# Altium schematic sheet A3_DSTU.SchDoc: Title 0
size 420 x 297 mm; ApprovedBy: Approved by; CheckedBy: Checked by; DrawnBy: Designed by; DocumentNumber: Document Number; SheetNumber: 1; SheetTotal: 1; Title1str: Title 1; DocumentType: Document Type; Format: A3
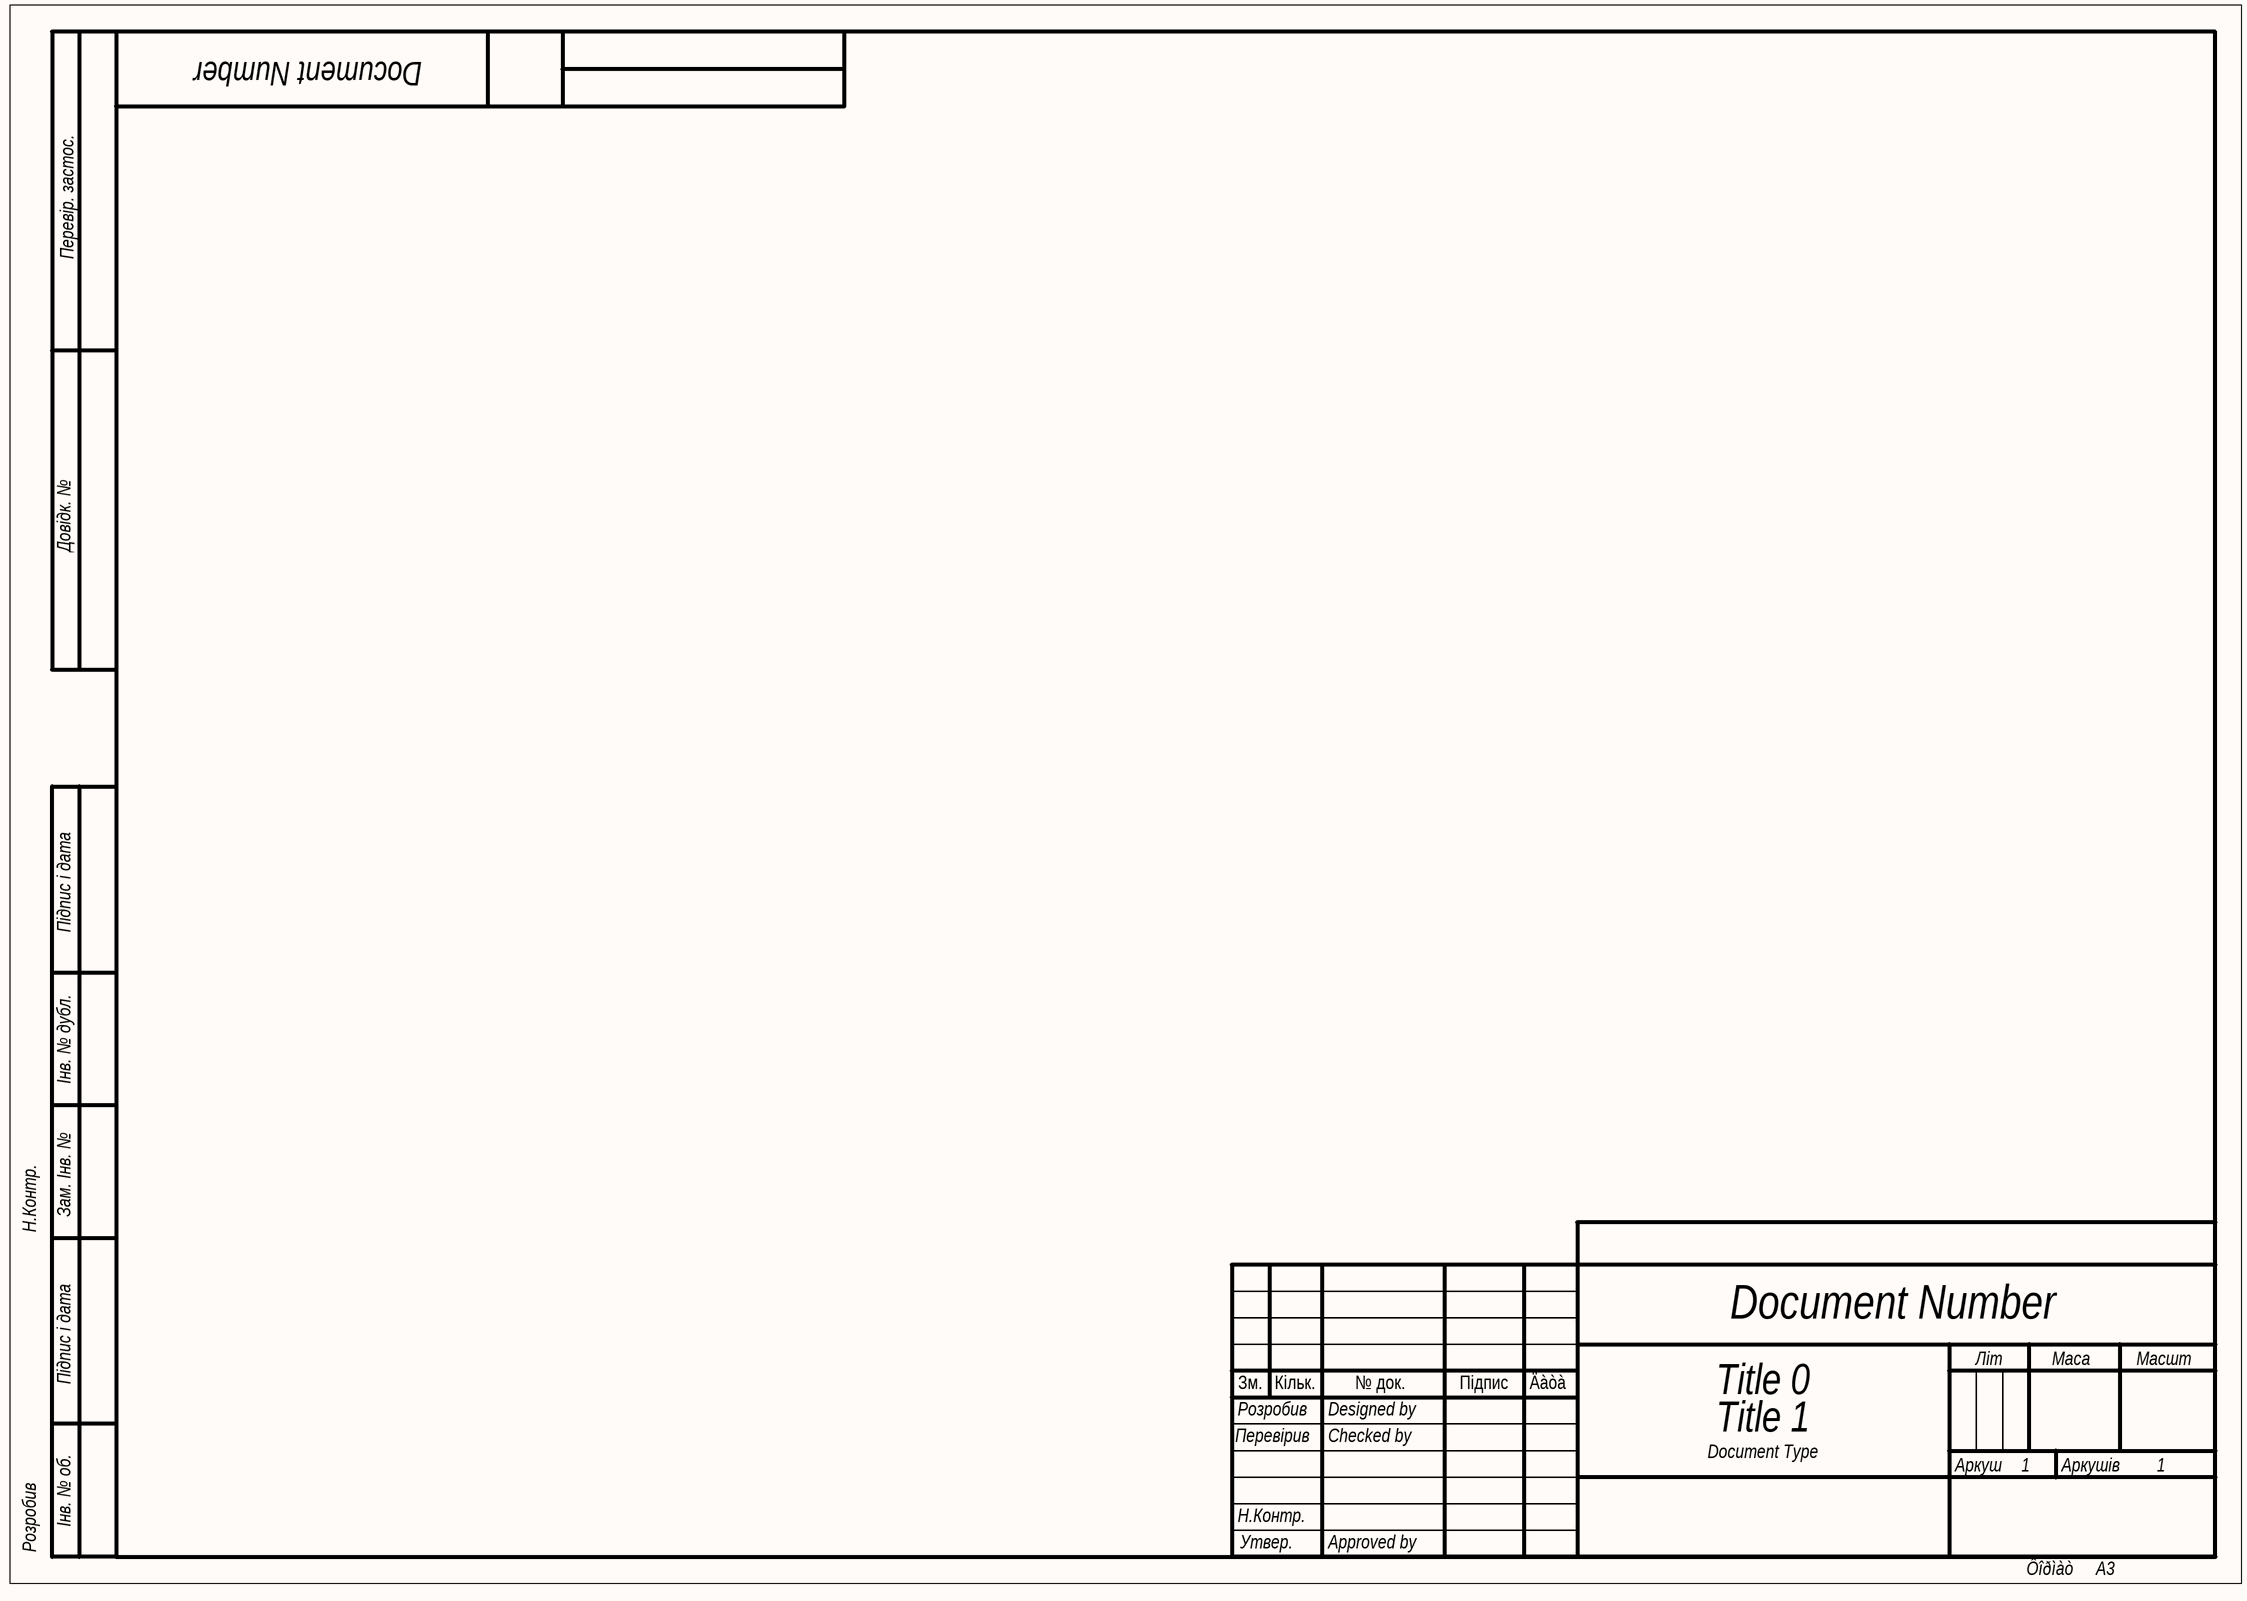
[diagram p0: A3_DSTU.SchDoc]

## Notes on the sheet
- Перевір. застос.
- Довідк. №
- Підпис і дата
- Інв. № дубл.
- Н.Контр.
- Зам. Інв. №
- Зм.
- Кільк.
- № док.
- Підпис
- Äàòà
- Літ
- Маса
- Масшт
- Перевірив
- Розробив
- Аркуш
- Аркушів
- Інв. № об.
- Утвер.
- Ôîðìàò